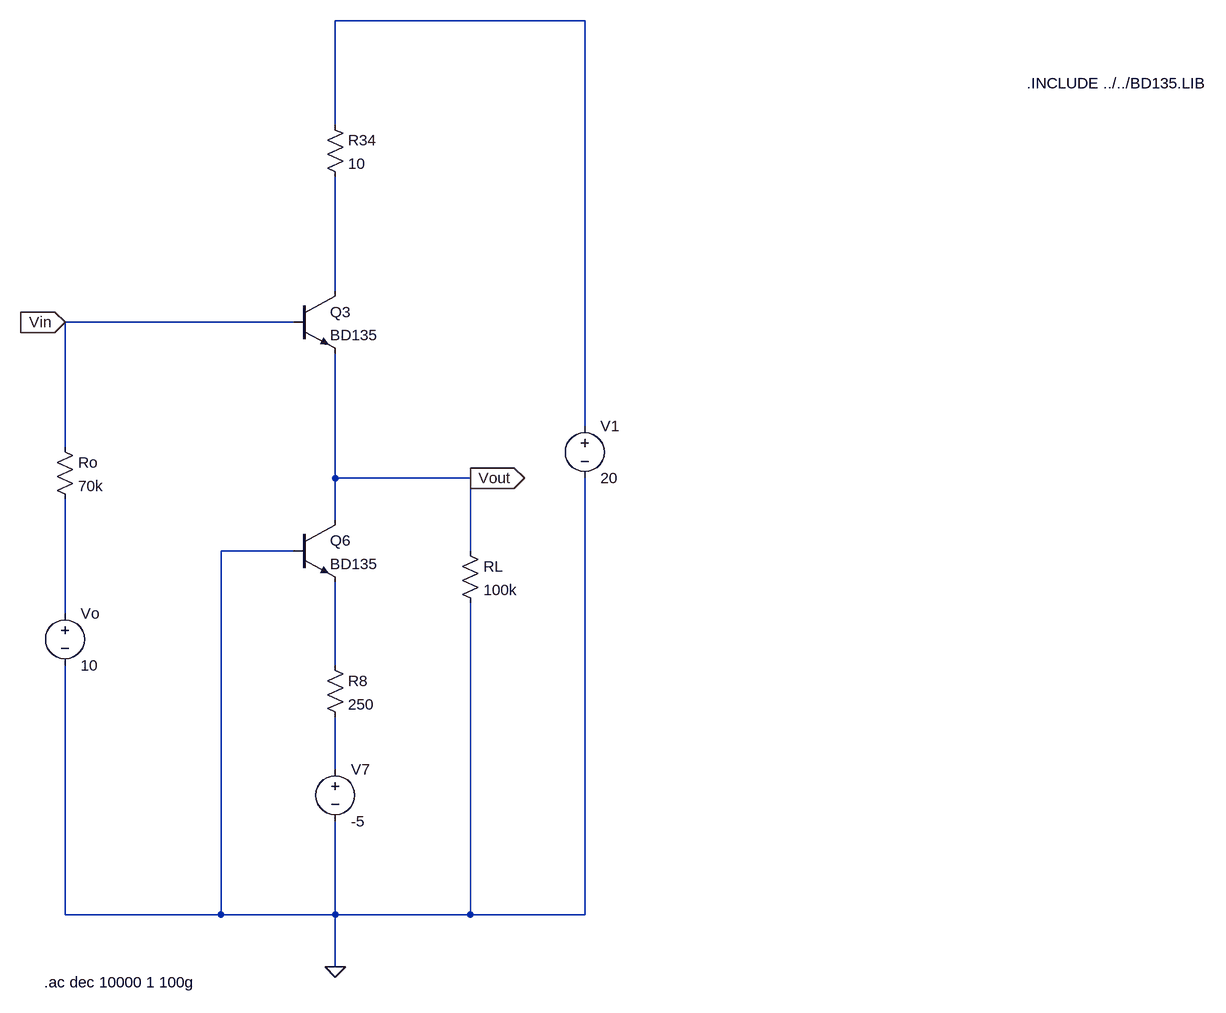
[diagram p0: schematic av.asc]
av.asc, the LTspice schematic file:
Version 4
SHEET 1 1572 1176
WIRE 592 -320 208 -320
WIRE 208 -160 208 -320
WIRE 208 96 208 -80
WIRE 144 144 -208 144
WIRE 592 304 592 -320
WIRE -208 336 -208 144
WIRE 208 384 208 192
WIRE 416 384 208 384
WIRE 208 448 208 384
WIRE 144 496 32 496
WIRE 416 496 416 384
WIRE -208 592 -208 416
WIRE 208 672 208 544
WIRE 208 832 208 752
WIRE -208 1056 -208 672
WIRE 32 1056 32 496
WIRE 32 1056 -208 1056
WIRE 208 1056 208 912
WIRE 208 1056 32 1056
WIRE 416 1056 416 576
WIRE 416 1056 208 1056
WIRE 592 1056 592 384
WIRE 592 1056 416 1056
WIRE 208 1136 208 1056
FLAG 208 1136 0
FLAG -208 144 Vin
IOPIN -208 144 In
FLAG 416 384 Vout
IOPIN 416 384 Out
SYMBOL npn 144 96 R0
SYMATTR InstName Q3
SYMATTR Value BD135
SYMBOL npn 144 448 R0
SYMATTR InstName Q6
SYMATTR Value BD135
SYMBOL res 192 656 R0
SYMATTR InstName R8
SYMATTR Value 250
SYMBOL res 192 -176 R0
SYMATTR InstName R34
SYMATTR Value 10
SYMBOL voltage 592 288 R0
WINDOW 123 0 0 Left 0
WINDOW 39 0 0 Left 0
SYMATTR InstName V1
SYMATTR Value 20
SYMBOL voltage 208 816 R0
WINDOW 123 0 0 Left 0
WINDOW 39 0 0 Left 0
SYMATTR InstName V7
SYMATTR Value -5
SYMBOL voltage -208 576 R0
WINDOW 123 0 0 Left 0
WINDOW 39 0 0 Left 0
SYMATTR InstName Vo
SYMATTR Value 10
SYMBOL res -224 320 R0
SYMATTR InstName Ro
SYMATTR Value 70k
SYMBOL res 400 480 R0
SYMATTR InstName RL
SYMATTR Value 100k
TEXT 1272 -224 Left 2 !.INCLUDE ../../BD135.LIB
TEXT -240 1160 Left 2 !.ac dec 10000 1 100g

The netlist it stands for:
* av.asc
Q3 N002 Vin Vout 0 BD135
Q6 Vout 0 N004 0 BD135
R8 N004 N005 250
R34 N001 N002 10
V1 N001 0 20
V7 N005 0 -5
Vo N003 0 10
Ro Vin N003 70k
RL Vout 0 100k
.model NPN NPN
.model PNP PNP
.lib standard.bjt
.INCLUDE ../../BD135.LIB
.ac dec 10000 1 100g
.backanno
.end